# EAGLE design PiKVM_USB_Adapter v1.5 (EAGLE 9.6.2)
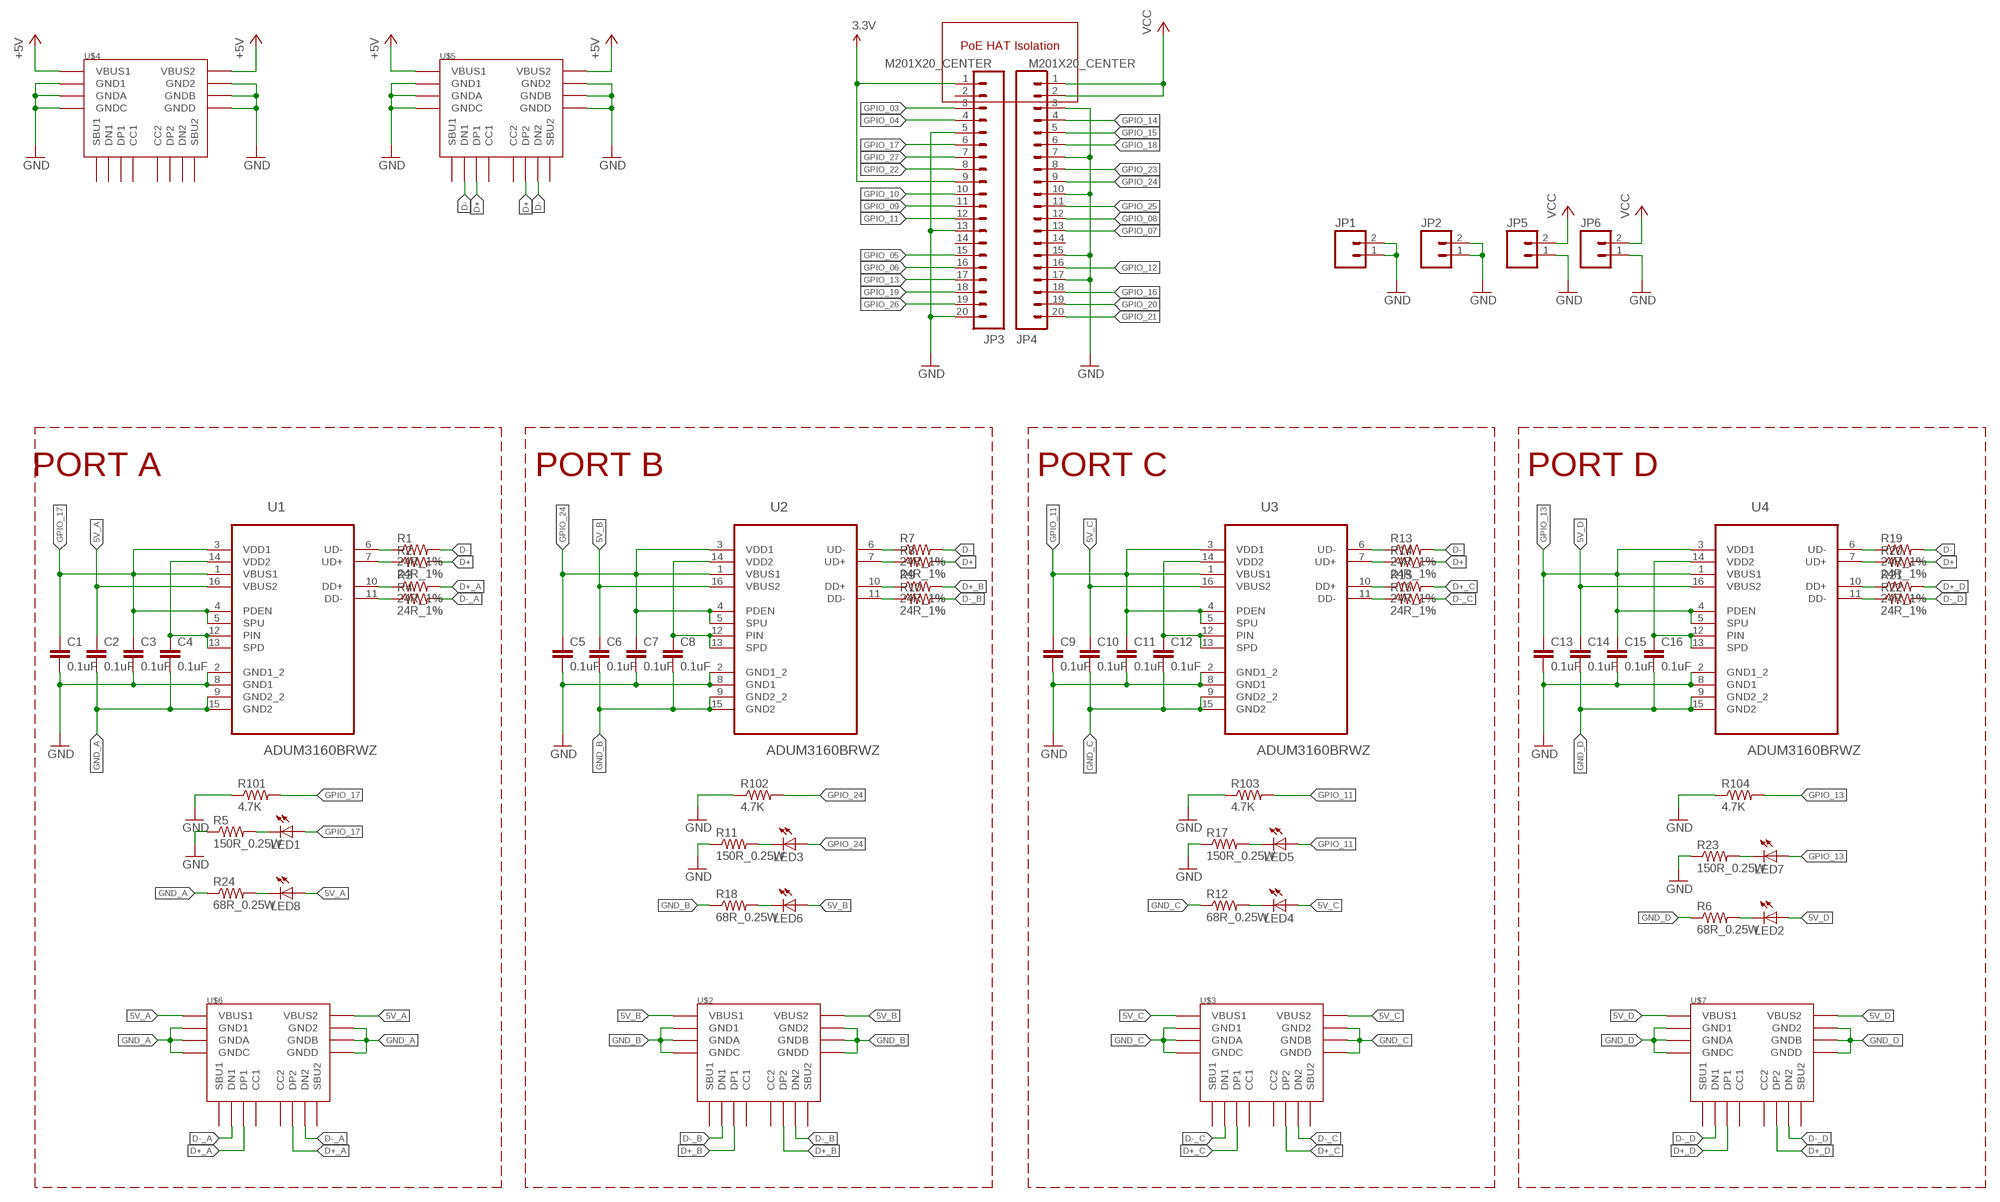
[diagram p0: schematic, sheet 1]

## Parts
C1  0.1uF  CAP0805  [0805]
C2  0.1uF  CAP0805  [0805]
C3  0.1uF  CAP0805  [0805]
C4  0.1uF  CAP0805  [0805]
C5  0.1uF  CAP0805  [0805]
C6  0.1uF  CAP0805  [0805]
C7  0.1uF  CAP0805  [0805]
C8  0.1uF  CAP0805  [0805]
C9  0.1uF  CAP0805  [0805]
C10  0.1uF  CAP0805  [0805]
C11  0.1uF  CAP0805  [0805]
C12  0.1uF  CAP0805  [0805]
C13  0.1uF  CAP0805  [0805]
C14  0.1uF  CAP0805  [0805]
C15  0.1uF  CAP0805  [0805]
C16  0.1uF  CAP0805  [0805]
JP1  M02LOCK  [1X02_LOCK]
JP2  M02LOCK  [1X02_LOCK]
JP3  M201X20_CENTER  [1X20_CENTER]
JP4  M201X20_CENTER  [1X20_CENTER]
JP5  M02LOCK  [1X02_LOCK]
JP6  M02LOCK  [1X02_LOCK]
LED1  LED1206  [LED-1206]
LED2  LED1206  [LED-1206]
LED3  LED1206  [LED-1206]
LED4  LED1206  [LED-1206]
LED5  LED1206  [LED-1206]
LED6  LED1206  [LED-1206]
LED7  LED1206  [LED-1206]
LED8  LED1206  [LED-1206]
R1  24R_1%  RESISTOR0805-RES  [0805]
R2  24R_1%  RESISTOR0805-RES  [0805]
R3  24R_1%  RESISTOR0805-RES  [0805]
R4  24R_1%  RESISTOR0805-RES  [0805]
R5  150R_0.25W  RESISTOR1206  [1206]
R6  68R_0.25W  RESISTOR1206  [1206]
R7  24R_1%  RESISTOR0805-RES  [0805]
R8  24R_1%  RESISTOR0805-RES  [0805]
R9  24R_1%  RESISTOR0805-RES  [0805]
R10  24R_1%  RESISTOR0805-RES  [0805]
R11  150R_0.25W  RESISTOR1206  [1206]
R12  68R_0.25W  RESISTOR1206  [1206]
R13  24R_1%  RESISTOR0805-RES  [0805]
R14  24R_1%  RESISTOR0805-RES  [0805]
R15  24R_1%  RESISTOR0805-RES  [0805]
R16  24R_1%  RESISTOR0805-RES  [0805]
R17  150R_0.25W  RESISTOR1206  [1206]
R18  68R_0.25W  RESISTOR1206  [1206]
R19  24R_1%  RESISTOR0805-RES  [0805]
R20  24R_1%  RESISTOR0805-RES  [0805]
R21  24R_1%  RESISTOR0805-RES  [0805]
R22  24R_1%  RESISTOR0805-RES  [0805]
R23  150R_0.25W  RESISTOR1206  [1206]
R24  68R_0.25W  RESISTOR1206  [1206]
R101  4.7K  RESISTOR1206  [1206]
R102  4.7K  RESISTOR1206  [1206]
R103  4.7K  RESISTOR1206  [1206]
R104  4.7K  RESISTOR1206  [1206]
U1  ADUM3160BRWZ  [SOIC127P1032X265-16N]
U2  ADUM3160BRWZ  [SOIC127P1032X265-16N]
U3  ADUM3160BRWZ  [SOIC127P1032X265-16N]
U4  ADUM3160BRWZ  [SOIC127P1032X265-16N]
U$2  USB4110GFA  [GCT_USB4110GFA]
U$3  USB4110GFA  [GCT_USB4110GFA]
U$4  USB4110GFA  [GCT_USB4110GFA]
U$5  USB4110GFA  [GCT_USB4110GFA]
U$6  USB4110GFA  [GCT_USB4110GFA]
U$7  USB4110GFA  [GCT_USB4110GFA]

## Nets
3.3V: JP3.1 JP3.9
5V_A: C2.1 LED8.A U1.16(VBUS2) U$6.A4B9(VBUS1) U$6.B4A9(VBUS2)
5V_B: C6.1 LED6.A U2.16(VBUS2) U$2.A4B9(VBUS1) U$2.B4A9(VBUS2)
5V_C: C10.1 LED4.A U3.16(VBUS2) U$3.A4B9(VBUS1) U$3.B4A9(VBUS2)
5V_D: C14.1 LED2.A U4.16(VBUS2) U$7.A4B9(VBUS1) U$7.B4A9(VBUS2)
+5V: U$4.A4B9(VBUS1) U$4.B4A9(VBUS2) U$5.A4B9(VBUS1) U$5.B4A9(VBUS2)
D+: R2.2 R8.2 R14.2 R20.2 U$5.A6(DP1) U$5.B6(DP2)
D+_A: R3.2 U$6.A6(DP1) U$6.B6(DP2)
D+_B: R9.2 U$2.A6(DP1) U$2.B6(DP2)
D+_C: R15.2 U$3.A6(DP1) U$3.B6(DP2)
D+_D: R21.2 U$7.A6(DP1) U$7.B6(DP2)
D-: R1.2 R7.2 R13.2 R19.2 U$5.A7(DN1) U$5.B7(DN2)
D-_A: R4.2 U$6.A7(DN1) U$6.B7(DN2)
D-_B: R10.2 U$2.A7(DN1) U$2.B7(DN2)
D-_C: R16.2 U$3.A7(DN1) U$3.B7(DN2)
D-_D: R22.2 U$7.A7(DN1) U$7.B7(DN2)
GND: C1.2 C3.2 C5.2 C7.2 C9.2 C11.2 C13.2 C15.2 JP1.1 JP1.2 JP2.1 JP2.2 JP3.5 JP3.13 JP3.20 JP4.3 JP4.7 JP4.10 JP4.15 JP4.17 JP5.1 JP6.1 R5.1 R11.1 R17.1 R23.1 R101.1 R102.1 R103.1 R104.1 U1.2(GND1_2) U1.8(GND1) U2.2(GND1_2) U2.8(GND1) U3.2(GND1_2) U3.8(GND1) U4.2(GND1_2) U4.8(GND1) U$4.A1B12(GND1) U$4.B1A12(GND2) U$4.GND1(GNDA) U$4.GND2(GNDB) U$4.GND3(GNDC) U$4.GND4(GNDD) U$5.A1B12(GND1) U$5.B1A12(GND2) U$5.GND1(GNDA) U$5.GND2(GNDB) U$5.GND3(GNDC) U$5.GND4(GNDD)
GND_A: C2.2 C4.2 R24.1 U1.9(GND2_2) U1.15(GND2) U$6.A1B12(GND1) U$6.B1A12(GND2) U$6.GND1(GNDA) U$6.GND2(GNDB) U$6.GND3(GNDC) U$6.GND4(GNDD)
GND_B: C6.2 C8.2 R18.1 U2.9(GND2_2) U2.15(GND2) U$2.A1B12(GND1) U$2.B1A12(GND2) U$2.GND1(GNDA) U$2.GND2(GNDB) U$2.GND3(GNDC) U$2.GND4(GNDD)
GND_C: C10.2 C12.2 R12.1 U3.9(GND2_2) U3.15(GND2) U$3.A1B12(GND1) U$3.B1A12(GND2) U$3.GND1(GNDA) U$3.GND2(GNDB) U$3.GND3(GNDC) U$3.GND4(GNDD)
GND_D: C14.2 C16.2 R6.1 U4.9(GND2_2) U4.15(GND2) U$7.A1B12(GND1) U$7.B1A12(GND2) U$7.GND1(GNDA) U$7.GND2(GNDB) U$7.GND3(GNDC) U$7.GND4(GNDD)
GPIO_03: JP3.3
GPIO_04: JP3.4
GPIO_05: JP3.15
GPIO_06: JP3.16
GPIO_07: JP4.13
GPIO_08: JP4.12
GPIO_09: JP3.11
GPIO_10: JP3.10
GPIO_11: C9.1 C11.1 JP3.12 LED5.A R103.2 U3.1(VBUS1) U3.3(VDD1) U3.4(PDEN) U3.5(SPU)
GPIO_12: JP4.16
GPIO_13: C13.1 C15.1 JP3.17 LED7.A R104.2 U4.1(VBUS1) U4.3(VDD1) U4.4(PDEN) U4.5(SPU)
GPIO_14: JP4.4
GPIO_15: JP4.5
GPIO_16: JP4.18
GPIO_17: C1.1 C3.1 JP3.6 LED1.A R101.2 U1.1(VBUS1) U1.3(VDD1) U1.4(PDEN) U1.5(SPU)
GPIO_18: JP4.6
GPIO_19: JP3.18
GPIO_20: JP4.19
GPIO_21: JP4.20
GPIO_22: JP3.8
GPIO_23: JP4.8
GPIO_24: C5.1 C7.1 JP4.9 LED3.A R102.2 U2.1(VBUS1) U2.3(VDD1) U2.4(PDEN) U2.5(SPU)
GPIO_25: JP4.11
GPIO_26: JP3.19
GPIO_27: JP3.7
N$1: C8.1 U2.12(PIN) U2.13(SPD) U2.14(VDD2)
N$2: R7.1 U2.6(UD-)
N$3: R8.1 U2.7(UD+)
N$4: R9.1 U2.10(DD+)
N$6: R10.1 U2.11(DD-)
N$8: LED3.C R11.2
N$9: C12.1 U3.12(PIN) U3.13(SPD) U3.14(VDD2)
N$10: R13.1 U3.6(UD-)
N$11: R14.1 U3.7(UD+)
N$12: R15.1 U3.10(DD+)
N$13: R16.1 U3.11(DD-)
N$14: LED2.C R6.2
N$15: LED5.C R17.2
N$16: C16.1 U4.12(PIN) U4.13(SPD) U4.14(VDD2)
N$17: R19.1 U4.6(UD-)
N$18: LED1.C R5.2
N$19: C4.1 U1.12(PIN) U1.13(SPD) U1.14(VDD2)
N$20: R20.1 U4.7(UD+)
N$21: R21.1 U4.10(DD+)
N$22: R22.1 U4.11(DD-)
N$23: R1.1 U1.6(UD-)
N$24: R2.1 U1.7(UD+)
N$25: R3.1 U1.10(DD+)
N$26: R4.1 U1.11(DD-)
N$27: LED4.C R12.2
N$28: LED7.C R23.2
N$29: LED6.C R18.2
N$30: LED8.C R24.2
VCC: JP4.1 JP4.2 JP5.2 JP6.2
Unconnected: JP3.2 JP3.14 JP4.14 U$2.A5(CC1) U$2.A8(SBU1) U$2.B5(CC2) U$2.B8(SBU2) U$3.A5(CC1) U$3.A8(SBU1) U$3.B5(CC2) U$3.B8(SBU2) U$4.A5(CC1) U$4.A6(DP1) U$4.A7(DN1) U$4.A8(SBU1) U$4.B5(CC2) U$4.B6(DP2) U$4.B7(DN2) U$4.B8(SBU2) U$5.A5(CC1) U$5.A8(SBU1) U$5.B5(CC2) U$5.B8(SBU2) U$6.A5(CC1) U$6.A8(SBU1) U$6.B5(CC2) U$6.B8(SBU2) U$7.A5(CC1) U$7.A8(SBU1) U$7.B5(CC2) U$7.B8(SBU2)

## Notes on the sheet
- PoE HAT Isolation
- PORT A | PORT B | PORT C | PORT D

## Library data of the parts
C1-C16 = SparkFun-Capacitors:CAP: Capacitor Standard 0603 ceramic capacitor, and 0.1" leaded capacitor.
JP1 JP2 JP5 JP6 = SparkFun-Connectors:M02: Header 2 Standard 2-pin 0.1" header. Use with straight break away headers (SKU : PRT-00116), right angle break away headers (PRT-00553), swiss pins (PRT-00743), machine pins (PRT-00117), and female headers (PRT-00115). Molex polarized connector foot print use with SKU : PRT-08233 with associated crimp pins and housings.
JP3 JP4 = SparkFun-Connectors:M20: 1x20 .1" header This is just like the LOCK variant in that the holes are staggared by 5 mil, but except for the last two holes. They are not altered from the "standard" footprint layout. This is used for a special purpose on the layout of our Graphic LCD Backpack. Make sure you want to use this device before selecting it for you project!
LED1-LED8 = SparkFun-LED:LED: LEDs Standard schematic elements and footprints for 5mm, 3mm, 1206, and 0603 sized LEDs. 5mm - Spark Fun Electronics SKU : COM-00529 (and others)
R1-R24 R101-R104 = SparkFun-Resistors:RESISTOR: Resistor Basic schematic elements and footprints for 0603, 1206, and PTH resistors.
U1-U4 = Analog Devices_By_element14_Batch_1:ADUM3160BRWZ: Full/Low Speed 2.5 kV USB Digital Isolator; MPN: ADUM3160BRWZ; OC_FARNELL: 1843660; OC_NEWARK: 85R6420; PACKAGE: SOIC-16; SUPPLIER: Analog Devices
U$2-U$7 = MY_adafruit:USB4110GFA

## Board
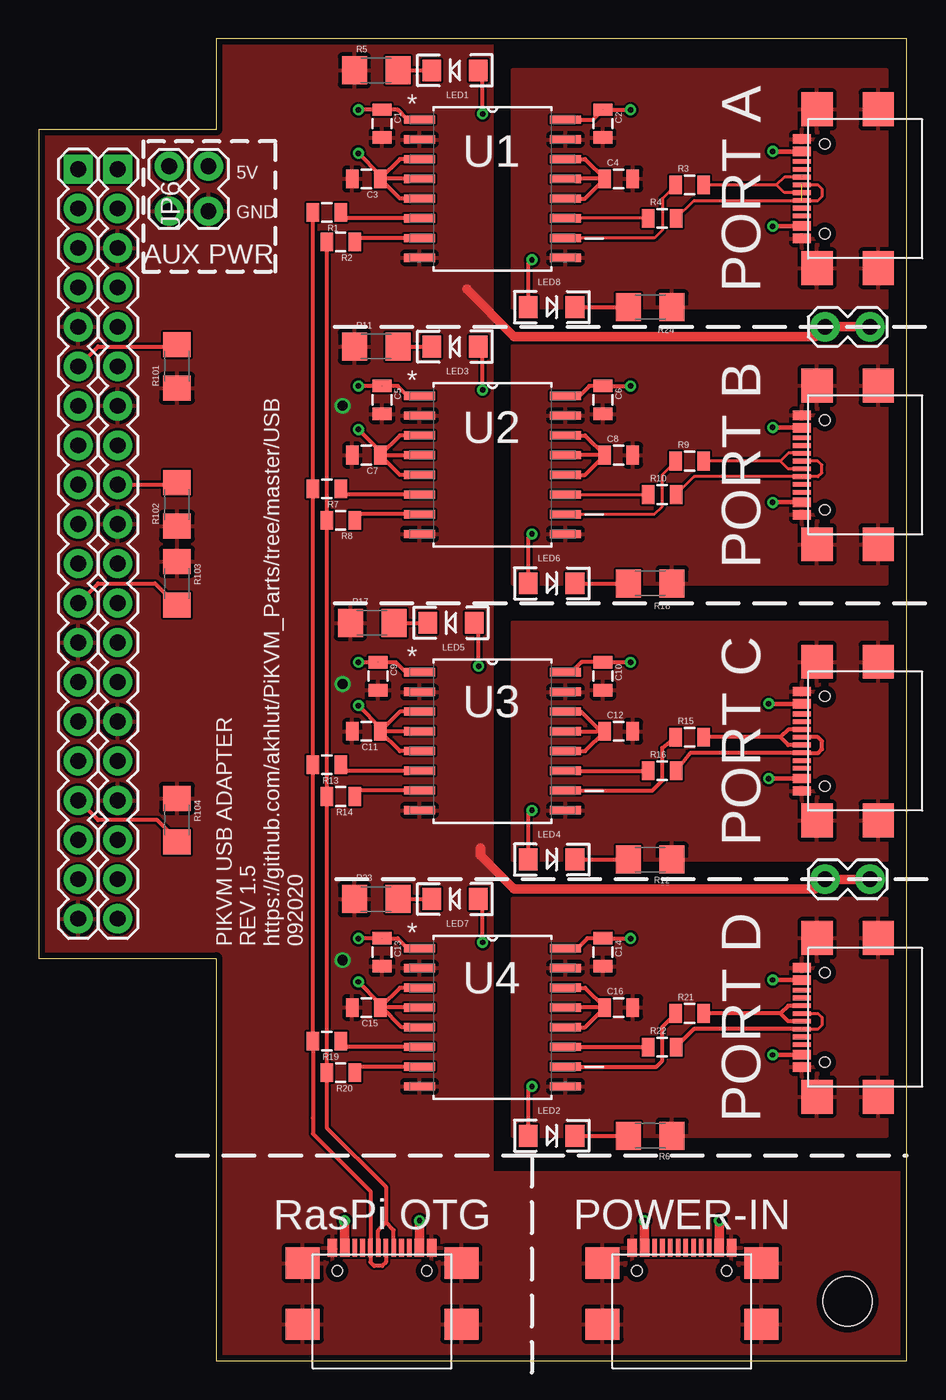
[diagram p1: board, top side]
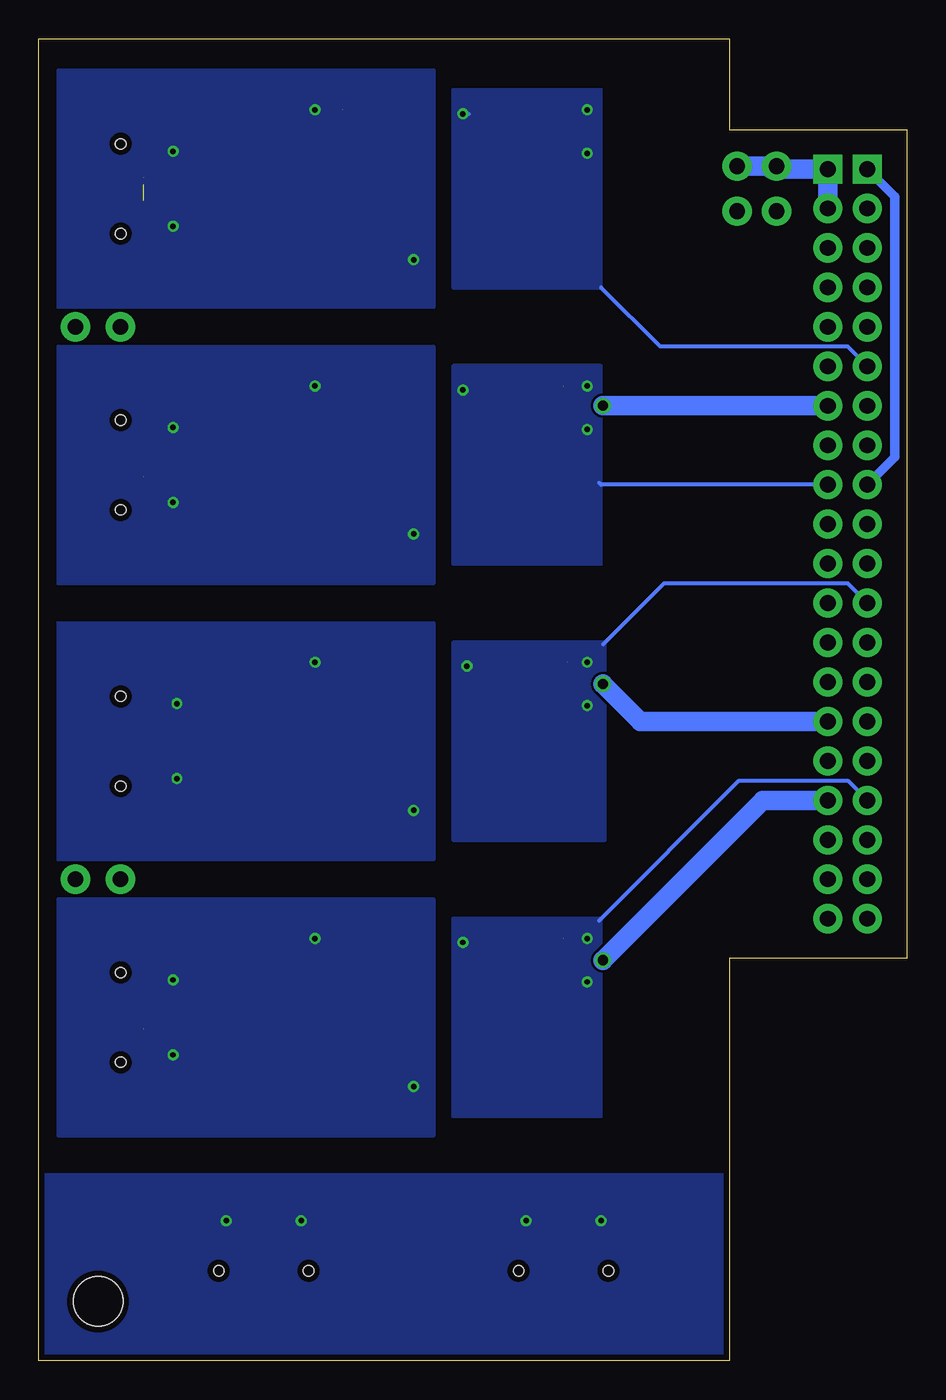
[diagram p2: board, bottom side, seen from below]

Size 55.88 x 85.09 mm. Coordinates in mm from the lower left corner, seen from the top.
Outline: 0,25.91 11.43,25.91 11.43,0 55.88,0 55.88,85.09 11.43,85.09 11.43,79.25 0,79.25 0,25.91
Copper layers (1*16): Top 0.0356mm / dielectric 1.5011mm / Bottom 0.0356mm
Design rules "LaenPCBOrder": minimum track width 6mil, minimum drill 13mil, track to track 6mil, track to pad 6mil, pad to pad 6mil, via to via 6mil, smd to smd 6mil, copper to edge 15mil, drill to drill 6mil, minimum pad ring 7mil, minimum via ring 7mil, stop-mask expansion 3mil, vias tented up to drill 0mil, thermal gap 10mil
Holes 3.17 mm at 52.07,3.81

### Footprints (pad centres in the part's own frame; a part is rotated, then mirrored left to right if it is on the bottom)
0805 = smd 0.8 x 1.2: 1 -0.9,0; 2 0.9,0
1X02_LOCK = drill 1.016 pad 1.88: 1 -0.178,0; 2 2.718,0
1X20_CENTER = drill 1.016 pad 1.88 square: 1 -24.13,0 | drill 1.016 pad 1.88: 2 -21.59,0; 3 -19.05,0; 4 -16.51,0; 5 -13.97,0; 6 -11.43,0; 7 -8.89,0; 8 -6.35,0; 9 -3.81,0; 10 -1.27,0; 11 1.27,0; 12 3.81,0; 13 6.35,0; 14 8.89,0; 15 11.43,0; 16 13.97,0; 17 16.51,0; 18 19.05,0; 19 21.59,0; 20 24.13,0
LED-1206 = smd 1.2 x 1.4: A -1.5,0; C 1.5,0
1206 = smd 1.6 x 1.8: 1 -1.4,0; 2 1.4,0
SOIC127P1032X265-16N = smd 1.981 x 0.533: 1 -4.699,4.445; 2 -4.699,3.175; 3 -4.699,1.905; 4 -4.699,0.635; 5 -4.699,-0.635; 6 -4.699,-1.905; 7 -4.699,-3.175; 8 -4.699,-4.445; 9 4.699,-4.445; 10 4.699,-3.175; 11 4.699,-1.905; 12 4.699,-0.635; 13 4.699,0.635; 14 4.699,1.905; 15 4.699,3.175; 16 4.699,4.445
GCT_USB4110GFA = smd 0.6 x 1.15: A1B12 -3.2,0.4; A4B9 -2.4,0.4; B1A12 3.2,0.4; B4A9 2.4,0.4 | smd 0.3 x 1.15: A5 -1.25,0.4; A6 -0.25,0.4; A7 0.25,0.4; A8 1.25,0.4; B5 1.75,0.4; B6 0.75,0.4; B7 -0.75,0.4; B8 -1.75,0.4 | smd 2.18 x 2: GND1 -5.11,-0.575; GND2 -5.11,-4.505; GND3 5.11,-0.575; GND4 5.11,-4.505 | hole 0.65: -2.89,-1.075; 2.89,-1.075

### Placement (x,y rotation side)
C1  22.1,79.63 270 top
C2  36.32,79.63 270 top
C3  21.08,76.07 180 top
C4  37.34,76.07 0 top
C5  22.1,61.85 270 top
C6  36.32,61.85 270 top
C7  21.08,58.29 180 top
C8  37.34,58.29 0 top
C9  21.84,44.07 270 top
C10  36.32,44.07 270 top
C11  21.08,40.51 180 top
C12  37.34,40.51 0 top
C13  22.1,26.29 270 top
C14  36.32,26.29 270 top
C15  21.08,22.73 180 top
C16  37.34,22.73 0 top
JP1  50.8,66.55 0 top
JP2  50.8,30.99 0 top
JP3  2.54,52.58 270 top
JP4  5.08,52.58 270 top
JP5  8.38,74.17 90 top
JP6  10.92,74.17 90 top
LED1  26.8,83.06 180 top
LED2  33.02,14.48 0 top
LED3  26.8,65.28 180 top
LED4  33.02,32.26 0 top
LED5  26.54,47.5 180 top
LED6  33.02,50.04 0 top
LED7  26.8,29.72 180 top
LED8  33.02,67.82 0 top
R1  18.54,73.91 180 top
R2  19.43,72.01 180 top
R3  41.91,75.69 0 top
R4  40.13,73.53 0 top
R5  21.72,83.06 0 top
R6  39.37,14.48 180 top
R7  18.54,56.13 180 top
R8  19.43,54.1 180 top
R9  41.91,57.91 0 top
R10  40.13,55.75 0 top
R11  21.72,65.28 0 top
R12  39.37,32.26 180 top
R13  18.54,38.35 180 top
R14  19.43,36.32 180 top
R15  41.91,40.13 0 top
R16  40.13,37.97 0 top
R17  21.46,47.5 0 top
R18  39.37,50.04 180 top
R19  18.54,20.57 180 top
R20  19.43,18.54 180 top
R21  41.91,22.35 0 top
R22  40.13,20.19 0 top
R23  21.72,29.72 0 top
R24  39.37,67.82 180 top
R101  8.89,64.01 90 top
R102  8.89,55.12 90 top
R103  8.89,50.04 270 top
R104  8.89,34.8 270 top
U1  29.21,75.44 0 top
U2  29.21,57.66 0 top
U3  29.21,39.88 0 top
U4  29.21,22.1 0 top
U$2  49.53,57.66 90 top
U$3  49.53,39.88 90 top
U$4  41.4,6.86 0 top
U$5  22.1,6.86 0 top
U$6  49.53,75.44 90 top
U$7  49.53,22.1 90 top

### Tracks (layer width: path | path; a pad name or v marks a point on that pad's centre or on a via)
3.3V
  Bottom 0.61: JP3.1 0.76,74.93 0.76,58.17 JP3.9
5V_A  (via drill 0.35)  (1 unrouted)
  Top 0.254: 33.92,79.89 U1.16 35.68,79.88 C2.1 37.96,80.53 v38.1,80.52 | LED8.A 31.52,70.64 v31.75,70.87
  Top 0.305: U$6.A4B9 49.12,73.03 v47.24,73.03 | U$6.B4A9 47.26,77.84 v47.24,77.85
  Bottom 0.254: v38.1,80.52 38.23,80.52
  pour Bottom: 30.48,67.82 54.61,67.82 54.61,83.06 30.48,83.06
5V_B  (via drill 0.35)
  Top 0.254: v38.1,62.74 38.09,62.75 C6.1 35.44,62.75 34.8,62.1 U2.16 | LED6.A 31.52,52.98 v31.75,53.21
  Top 0.305: U$2.B4A9 47.26,60.06 v47.24,60.07 | U$2.A4B9 47.26,55.26 v47.24,55.24
  pour Bottom: 30.48,50.04 54.61,50.04 54.61,65.28 30.48,65.28
5V_C  (via drill 0.35)
  Top 0.254: U3.16 34.29,44.32 34.94,44.97 C10.1 37.84,44.97 v38.1,44.96 | 31.24,32.28 LED4.A 31.52,35.2 v31.75,35.43
  Top 0.305: U$3.A4B9 49.12,37.47 v46.99,37.47 | U$3.B4A9 47,42.28 v46.99,42.29
  pour Bottom: 30.48,32.26 54.61,32.26 54.61,47.5 30.48,47.5
5V_D  (via drill 0.35)
  Top 0.254: U4.16 34.67,26.54 35.32,27.19 C14.1 38.09,27.19 v38.1,27.18 | LED2.A 31.52,17.42 v31.75,17.65
  Top 0.305: U$7.A4B9 49.12,19.68 v47.24,19.68 | U$7.B4A9 47.26,24.5 v47.24,24.51
  pour Bottom: 30.48,14.48 54.61,14.48 54.61,29.72 30.48,29.72
+5V  (via drill 0.35)
  Top 0.61: U$5.A4B9 19.7,9.02 v19.68,9.02 | U$5.B4A9 24.5,9.02 v24.51,9.02 | U$4.A4B9 39,9.02 v38.99,9.02 | U$4.B4A9 v43.8,9.02 v43.81,9.02
  pour Bottom: 7.62,11.94 55.88,11.94 55.88,0 7.62,0
D+
  Top 0.254: U$5.A6 21.85,8.39 22.35,8.89 | U$5.B6 22.85,8.39 22.35,8.89 | 22.35,8.89 22.35,11.18 18.53,15 18.53,15.63 | R2.2 R8.2 R14.2 R20.2 18.53,15.63 | 18.53,15.63 18.54,15.62
D+_A  (1 unrouted)
  Top 0.203: U$6.B6 49.52,76.19 48.01,76.2 47.5,75.69 | 47.5,75.69 48,75.19 U$6.A6 | R3.2 47.5,75.69
D+_B
  Top 0.203: 47.75,57.91 R9.2 | 49.12,58.42 U$2.B6 48.25,58.41 47.75,57.91 | U$2.A6 48.26,57.41 47.75,57.91
D+_C
  Top 0.203: U$3.A6
  Top 0.254: 47.75,40.13 R15.2 | U$3.B6 48.25,40.63 47.75,40.13 | U$3.A6 48.26,39.63 47.75,40.13
D+_D
  Top 0.254: 47.75,22.35 R21.2 | U$7.B6 48.25,22.85 47.75,22.35 | U$7.A6 48.26,21.85 47.75,22.35
D-
  Top 0.254: U$5.A7 22.35,6.35 22.1,6.1 21.59,6.1 21.35,6.34 U$5.B7 21.35,10.91 17.64,14.62 17.64,15.63 | R1.2 R7.2 R13.2 R19.2 17.64,15.63 | 17.64,15.63 17.65,15.62
  Top 0.305: 17.64,74.04 R1.2
D-_A  (3 unrouted)
  Top 0.203: U$6.A7 49.53,75.69 50.16,75.69 50.42,75.44 50.42,74.93 50.16,74.68 42.17,74.68 R4.2 | 49.54,74.68 U$6.B7
D-_B  (1 unrouted)
  Top 0.203: R10.2 42.19,56.91 U$2.B7 49.14,56.9 50.16,56.9 50.42,57.15 50.42,57.66 50.17,57.91 U$2.A7
D-_C
  Top 0.254: R16.2 41.92,39.12 49.12,39.12 U$3.B7 50.18,39.13 50.42,39.37 50.42,39.88 50.16,40.13 U$3.A7
D-_D  (1 unrouted)
  Top 0.203: U$7.A7 50.17,22.35 50.42,22.1 50.42,21.59 50.16,21.34 49.14,21.34 U$7.B7
  Top 0.254: U$7.B7 42.19,21.35 R22.2
GND  (via drill 0.65)
  Top 0.61: U$5.GND3 27.62,6.7 | JP1.2 JP1.1 49.99,65.91 30.61,65.91 27.56,68.96 | JP2.2 JP2.1 49.99,30.35 30.61,30.35 28.45,32.51 28.45,33.02
  Bottom 1.27: JP4.7 v19.56,61.47 | JP4.15 17.14,41.15 v19.56,43.56 | JP4.17 9.27,36.07 v19.56,25.78
  pour Top: 29.21,85.09 0,85.09 0,0 29.21,0
  pour Top: 7.62,12.06 7.62,0 55.88,0 55.88,12.06
GND_A
  pour Top: 30.48,83.06 30.48,67.82 54.61,67.82 54.61,83.06
GND_B
  pour Top: 30.48,65.28 30.48,50.04 54.61,50.04 54.61,65.28
GND_C
  pour Top: 30.48,47.5 30.48,32.26 54.61,32.26 54.61,47.5
GND_D
  pour Top: 30.48,29.72 30.48,14.48 54.61,14.48 54.61,29.72
GPIO_11  (via drill 0.35)  (1 unrouted)
  Top 0.254: 28.45,47.09 LED5.A 28.32,47.22 v28.32,44.7 | v20.57,44.96 21.83,44.96 C9.1 22.98,44.97 23.62,44.32 U3.1 | C11.1 21.73,40.76 | R103.2 7.49,50.04 3.81,50.04 JP3.12 | v20.57,42.16 21.98,40.76 C11.1 | U3.4 C11.1 | U3.3 23.25,41.78 C11.1 | U3.5 23.25,39.24 C11.1
  Bottom 0.254: JP3.12 3.81,50.04 15.62,50.04 19.56,46.1
  pour Bottom: 19.43,46.23 29.21,46.23 29.21,33.53 19.43,33.53
GPIO_13  (via drill 0.35)  (1 unrouted)
  Top 0.254: U4.1 23.75,26.54 23.1,27.19 C13.1 22.09,27.18 v20.57,27.18 | U4.4 22.1,22.73 | 22.1,22.73 C15.1 | U4.3 23.25,24 C15.1 | U4.5 23.37,21.46 22.1,22.73 | v28.57,26.92 28.57,29.44 LED7.A | C15.1 21.98,22.98 v20.57,24.38 | R104.2 8.89,33.53 7.62,34.8 3.81,34.8 JP3.17
  Bottom 0.254: JP3.17 3.81,37.34 10.79,37.34 19.81,28.32
  pour Bottom: 19.68,28.45 29.21,28.45 29.21,15.75 19.68,15.75
GPIO_17  (via drill 0.35)
  Top 0.254: U1.4 C3.1 | U1.3 23.25,77.34 C3.1 | U1.5 23.25,74.8 C3.1 | C1.1 22.1,80.52 | 22.1,80.52 v20.57,80.52 | v28.57,80.26 28.57,82.78 LED1.A | U1.1 23.75,79.88 23.11,80.52 22.1,80.52 | C3.1 21.98,76.32 v20.57,77.72 | R101.2 8.76,65.28 3.81,65.28 JP3.6
  Bottom 0.254: v28.57,80.26 28.19,80.26 | JP3.6 3.81,65.28 15.88,65.28 19.68,69.09
  pour Bottom: 19.68,81.79 29.21,81.79 29.21,69.09 19.68,69.09
GPIO_24  (via drill 0.35)  (1 unrouted)
  Top 0.254: v28.57,62.48 28.57,65 LED3.A | v20.57,62.74 22.09,62.74 C5.1 23.1,62.75 23.75,62.1 U2.1 | C7.1 U2.4 | U2.3 23.25,59.56 C7.1 | U2.5 23.25,57.02 C7.1 | v20.57,59.94 21.98,58.54 C7.1 | R102.2 8.76,56.39 JP4.9
  Bottom 0.254: JP4.9 19.68,56.39 19.81,56.52
  pour Bottom: 19.68,64.01 29.21,64.01 29.21,51.31 19.68,51.31
N$1
  Top 0.254: C8.1 U2.13 | U2.14 35.17,59.56 C8.1 | U2.12 35.17,57.02 C8.1
N$2
  Top 0.254: U2.6 19.82,55.75 R7.1
N$3
  Top 0.254: U2.7 20.71,54.48 R8.1
N$4
  Top 0.203: R9.1 40.13,57.03 40.13,54.99 39.62,54.48 U2.10
N$6
  Top 0.203: U2.11 R10.1
N$8
  Top 0.254: R11.2 LED3.C
N$9
  Top 0.254: U3.14 34.91,41.78 36.06,40.63 | U3.12 35.17,39.24 C12.1 36.19,40.76 36.06,40.63 | U3.13 35.94,40.51 36.06,40.63
N$10
  Top 0.254: U3.6 19.82,37.97 R13.1
N$11
  Top 0.254: U3.7 20.71,36.7 R14.1
N$12
  Top 0.254: U3.10 39.5,36.7 40.13,37.34 40.13,39.45 R15.1
N$13
  Top 0.254: U3.11 R16.1
N$14
  Top 0.254: LED2.C R6.2
N$15
  Top 0.254: R17.2 LED5.C
N$16
  Top 0.254: C16.1 U4.13 | U4.14 35.17,24 C16.1 | U4.12 35.17,21.46 C16.1
N$17
  Top 0.254: U4.6 19.82,20.19 R19.1
N$18
  Top 0.254: R5.2 LED1.C
N$19
  Top 0.254: U1.12 35.17,74.8 C4.1 | C4.1 U1.13 | U1.14 35.17,77.34 C4.1
N$20
  Top 0.254: U4.7 20.71,18.92 R20.1
N$21
  Top 0.254: U4.10 39.75,18.92 40.13,19.3 40.13,21.47 R21.1
N$22
  Top 0.254: U4.11 R22.1
N$23
  Top 0.254: U1.6 19.82,73.53 R1.1
N$24
  Top 0.254: U1.7 20.59,72.26 R2.1
N$25
  Top 0.203: R3.1 40.13,74.81 40.13,72.77 39.62,72.26 U1.10
N$26
  Top 0.203: R4.1 U1.11
N$27
  Top 0.254: LED4.C R12.2
N$28
  Top 0.254: R23.2 LED7.C
N$29
  Top 0.254: LED6.C R18.2
N$30
  Top 0.254: LED8.C R24.2
VCC
  Bottom 1.27: JP4.2 JP4.1 8.71,76.71 JP5.2 JP6.2

### Text on the board
tPlace: 5V | GND | AUX PWR
tNames: PORT A | PORT B | PORT C | PIKVM USB ADAPTER / REV 1.5 / https://github.com/akhlut/PiKVM_Parts/tree/master/USB / 092020 | PORT D | RasPi OTG | POWER-IN